# EAGLE design Ganganzeige_v2 (EAGLE 6.5.0)
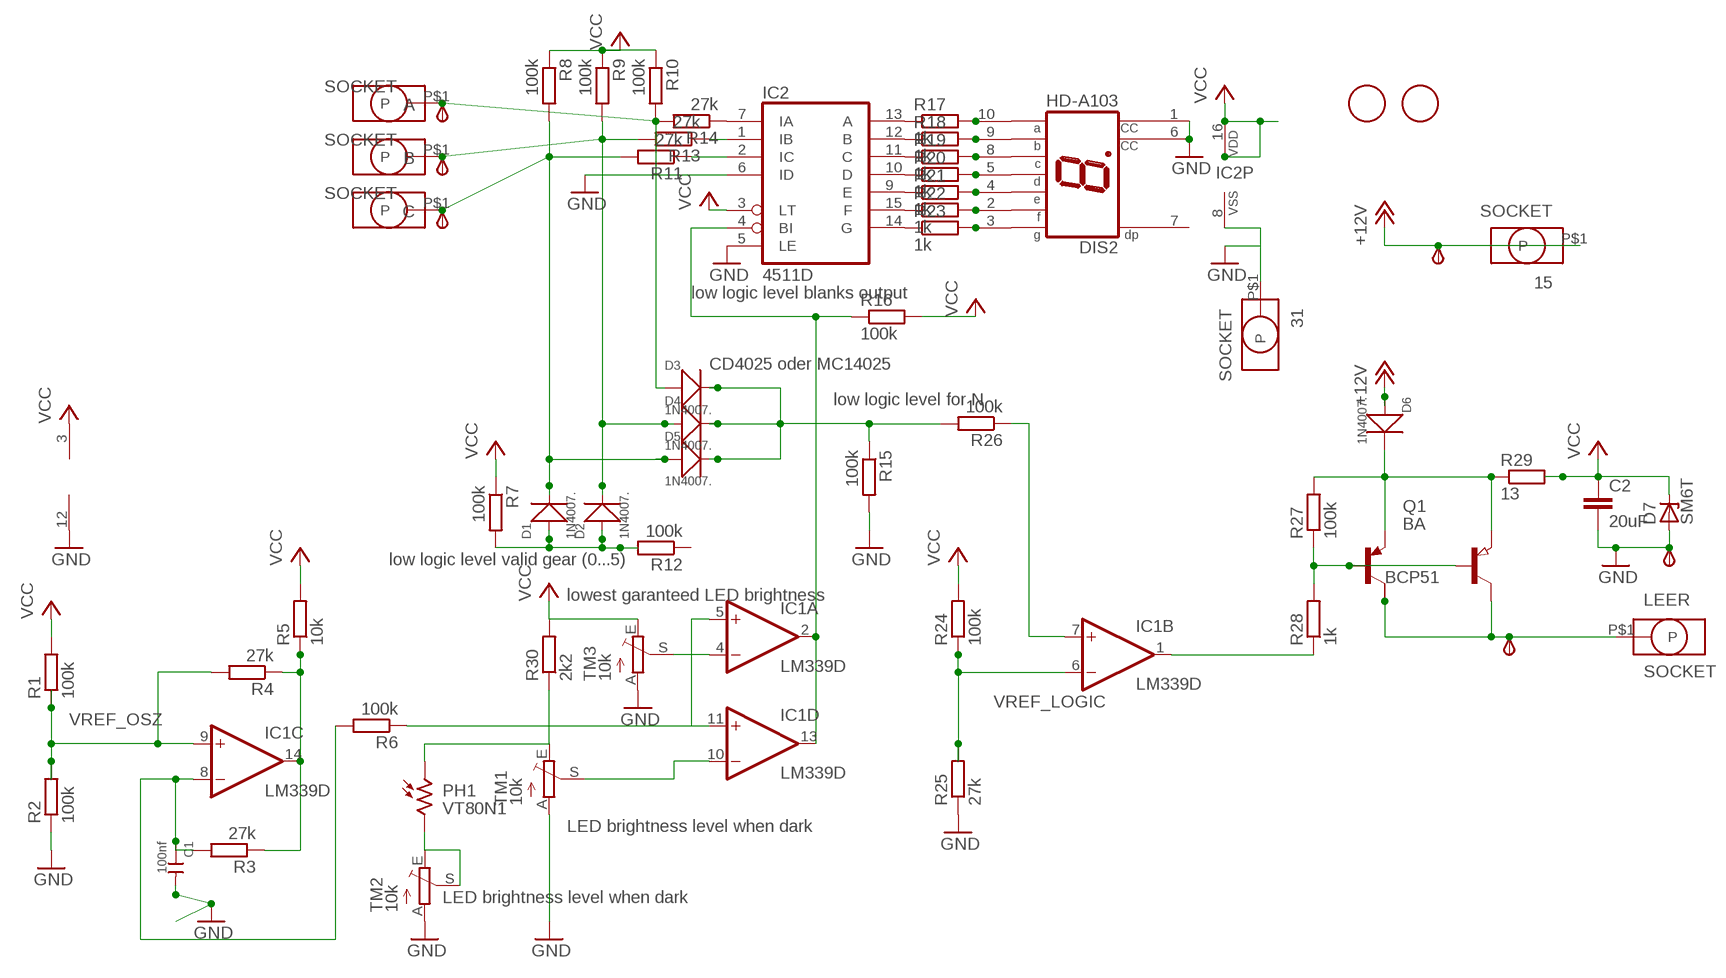
[diagram p0: schematic, sheet 1]

## Parts
15  SOCKET  [ID2.5MM]
15_  TPSB2.0  [B2.0]
31  SOCKET  [ID2.5MM]
A  SOCKET  [ID2.5MM]
A_  TPSB2.0  [B2.0]
B  SOCKET  [ID2.5MM]
B_  TPSB2.0  [B2.0]
C  SOCKET  [ID2.5MM]
C1  100nf  CERAMIC-100NF-50V-10%-X7R(0805)  [C0805]
C2  20uF  C-EUC1206K  [C1206K]
C_  TPSB2.0  [B2.0]
D1  1N4007.  DIODE-GEN-PURPOSE-1KV-1A(DO-214AC)  [DO-214AC]
D2  1N4007.  DIODE-GEN-PURPOSE-1KV-1A(DO-214AC)  [DO-214AC]
D3  1N4007.  DIODE-GEN-PURPOSE-1KV-1A(DO-214AC)  [DO-214AC]
D4  1N4007.  DIODE-GEN-PURPOSE-1KV-1A(DO-214AC)  [DO-214AC]
D5  1N4007.  DIODE-GEN-PURPOSE-1KV-1A(DO-214AC)  [DO-214AC]
D6  1N4007.  DIODE-GEN-PURPOSE-1KV-1A(DO-214AC)  [DO-214AC]
D7  SM6T  [DO214AA]
DIS2  HD-A103  [HDSP-A]
FID1  FIDUCIAL  [FIDUCIAL_1MM]
FID2  FIDUCIAL  [FIDUCIAL_1MM]
GND_  TPSB2.0  [B2.0]
IC1  LM339D  [SO14]
IC2  4511D  [SO16]
LEER  SOCKET  [ID2.5MM]
LEER_  TPSB2.0  [B2.0]
PH1  VT80N1  [VT800]
Q1  BA  PNP-TRANSISTOR_SOT89  [SOT89]
R1  100k  R-EU_R0805  [R0805]
R2  100k  R-EU_R0805  [R0805]
R3  27k  R-EU_R0805  [R0805]
R4  27k  R-EU_R0805  [R0805]
R5  10k  R-EU_R0805  [R0805]
R6  100k  R-EU_R0805  [R0805]
R7  100k  R-EU_R0805  [R0805]
R8  100k  R-EU_R0805  [R0805]
R9  100k  R-EU_R0805  [R0805]
R10  100k  R-EU_R0805  [R0805]
R11  27k  R-EU_R0805  [R0805]
R12  100k  R-EU_R0805  [R0805]
R13  27k  R-EU_R0805  [R0805]
R14  27k  R-EU_R0805  [R0805]
R15  100k  R-EU_R0805  [R0805]
R16  100k  R-EU_R0805  [R0805]
R17  1k  R-EU_R0805  [R0805]
R18  1k  R-EU_R0805  [R0805]
R19  1k  R-EU_R0805  [R0805]
R20  1k  R-EU_R0805  [R0805]
R21  1k  R-EU_R0805  [R0805]
R22  1k  R-EU_R0805  [R0805]
R23  1k  R-EU_R0805  [R0805]
R24  100k  R-EU_R0805  [R0805]
R25  27k  R-EU_R0805  [R0805]
R26  100k  R-EU_R0805  [R0805]
R27  100k  R-EU_R0805  [R0805]
R28  1k  R-EU_R0805  [R0805]
R29  13  R-EU_R1206  [R1206]
R30  2k2  R-EU_R0805  [R0805]
T  BCP53T1  [SOT223]
TM1  10k  TRIM_EU-S63X  [S63X]
TM2  10k  TRIM_EU-S63X  [S63X]
TM3  10k  TRIM_EU-S63X  [S63X]

## Nets
+12V: 15.P$1(P) 15_.TP(PP) D6.1(+)
GND: 31.P$1(P) C1.2 C2.2 D7.A DIS2.1(CC) DIS2.6(CC) GND_.TP(PP) IC1.12(P:GND) IC2.5(LE) IC2.6(ID) IC2.8(VSS) R2.1 R15.2 R25.1 TM1.A TM2.A TM3.A
N$1: IC2.13(A) R17.1
N$2: DIS2.10(A) R17.2
N$3: IC2.12(B) R18.1
N$4: DIS2.9(B) R18.2
N$5: IC2.11(C) R19.1
N$6: DIS2.8(C) R19.2
N$7: IC2.10(D) R20.1
N$8: DIS2.5(D) R20.2
N$9: IC2.9(E) R21.1
N$10: PH1.1 R30.1 TM1.E
N$11: DIS2.4(E) R21.2
N$12: IC2.15(F) R22.1
N$13: DIS2.2(F) R22.2
N$14: IC2.14(G) R23.1
N$15: DIS2.3(G) R23.2
N$16: A.P$1(P) A_.TP(PP) D3.1(+) R10.2 R14.2
N$17: B.P$1(P) B_.TP(PP) D2.2(-) D4.1(+) R9.2 R13.2
N$18: C.P$1(P) C_.TP(PP) D1.2(-) D5.1(+) R8.2 R11.2
N$21: IC1.1(B:OUT) R28.1
N$22: Q1.1(B) R27.1 R28.2 T.1(B)
N$24: PH1.2 TM2.E TM2.S
N$25: C1.1 IC1.8(C:-IN) R3.2 R6.2
N$26: IC1.14(C:OUT) R3.1 R4.1 R5.1
N$27: D1.1(+) D2.1(+) R7.2 R12.2
N$28: IC1.2(A:OUT) IC1.13(D:OUT) IC2.4(BI) R16.1
N$29: IC1.5(A:+IN) IC1.11(D:+IN) R6.1
N$30: IC1.10(D:-IN) TM1.S
N$31: IC1.4(A:-IN) TM3.S
N$32: IC1.7(B:+IN) R26.1
N$34: IC2.7(IA) R14.1
N$35: D3.2(-) D4.2(-) D5.2(-) R15.1 R26.2
N$36: IC2.2(IC) R11.1
N$37: IC2.1(IB) R13.1
VCC [VCC]: C2.1 D7.C IC1.3(P:V+) IC2.3(LT) IC2.16(VDD) R1.2 R5.2 R7.1 R8.1 R9.1 R10.1 R16.2 R24.2 R29.2 R30.2 TM3.E
VREF_LOGIC: IC1.6(B:-IN) R24.1 R25.2
VREF_OSZ: IC1.9(C:+IN) R1.1 R2.2 R4.2
ZUEND_EIN [Zuendplus]: D6.2(-) Q1.3(E) R27.2 R29.1 T.3(E)
ZUENDPLUS_OUT [Zuendplus]: LEER.P$1(P) LEER_.TP(PP) Q1.2(C) T.2(C)
Unconnected: DIS2.7(DP) R12.1 T.4(C/)

## Notes on the sheet
- low logic level blanks output
- CD4025 oder MC14025
- low logic level for N
- low logic level valid gear (0...5)
- lowest garanteed LED brightness
- LED brightness level when dark
- LED brightness level when dark

## Library data of the parts
15 31 A B C LEER = Brotbox_Socket_Header:SOCKET
15_ A_ B_ C_ GND_ LEER_ = testpin_BMW:TPS: TEST PIN
C1 = Seeed-Capacitor-2016:CERAMIC-100NF-50V-10%-X7R(0805): 302010165; MPN: CC0805KRX7R9BB104
C2 = rcl:C-EU: CAPACITOR, European symbol
D1-D6 = Diode-do214ac:DIODE-GEN-PURPOSE-1KV-1A(DO-214AC): 304010013; MPN: 1N4007; VALUE: 1N4007
D7 = Suppressor_Diode_DO214AA:SM6T: Z DIODE
DIS2 = display-hp:HD-A103: LED DISPLAY 1-character 7 segment, decimal point right; OC_FARNELL: unknown; OC_NEWARK: unknown
FID1 FID2 = Fiducial:FIDUCIAL: For use by pick and place machines to calibrate the vision/machine, 1mm By microbuilder.eu
IC1 = LM339:LM339: Low Power Low Offset Voltage Quad Comparators with open collector; LM139/LM239/LM339/LM2901/LM3302
IC2 = 45xx:4511: BCD to 7-segment LATCH/DECODER/DRIVER
PH1 = photo-elements:VT8: Photoconductive Cell VT800 Series Source: http://optoelectronics.perkinelmer.com/content/Datasheets/DTS_vt800seriesdatasheet.pdf
Q1 = Transistor_SOT89:PNP-TRANSISTOR_: PNP TRANSISTOR
R1-R30 = rcl:R-EU_: RESISTOR, European symbol
T = BCP53_:BCP53*; T: BCP51
TM1-TM3 = pot:TRIM_EU-: POTENTIOMETER

## Net classes
1 VCC: width 0.6 mm
2 Zuendplus: width 1 mm, drill 0.6 mm

## Board
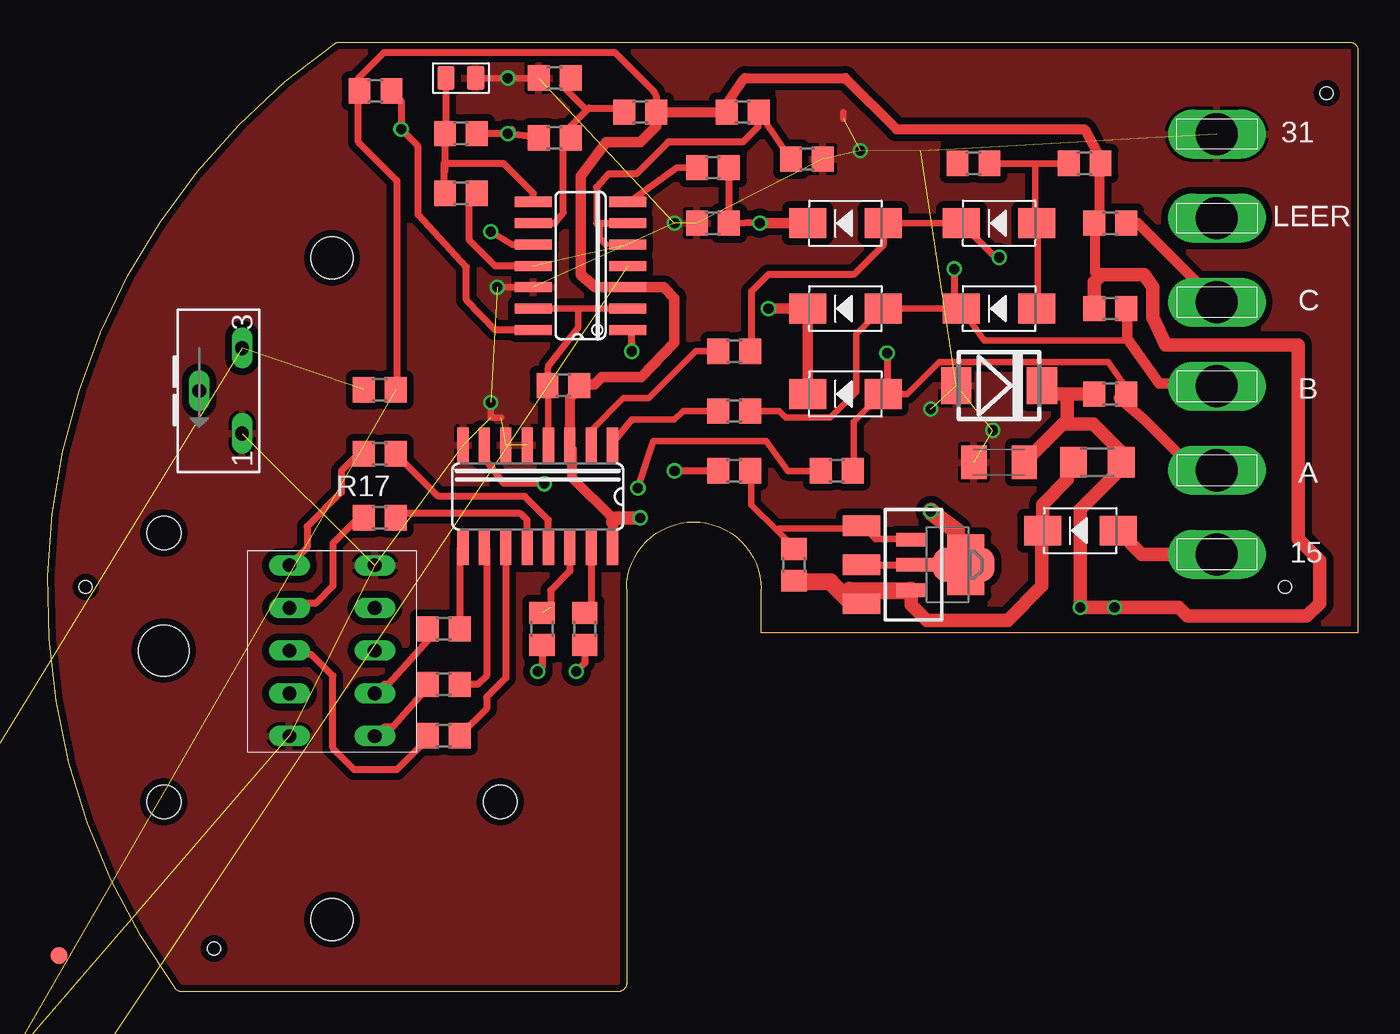
[diagram p1: board, top side]
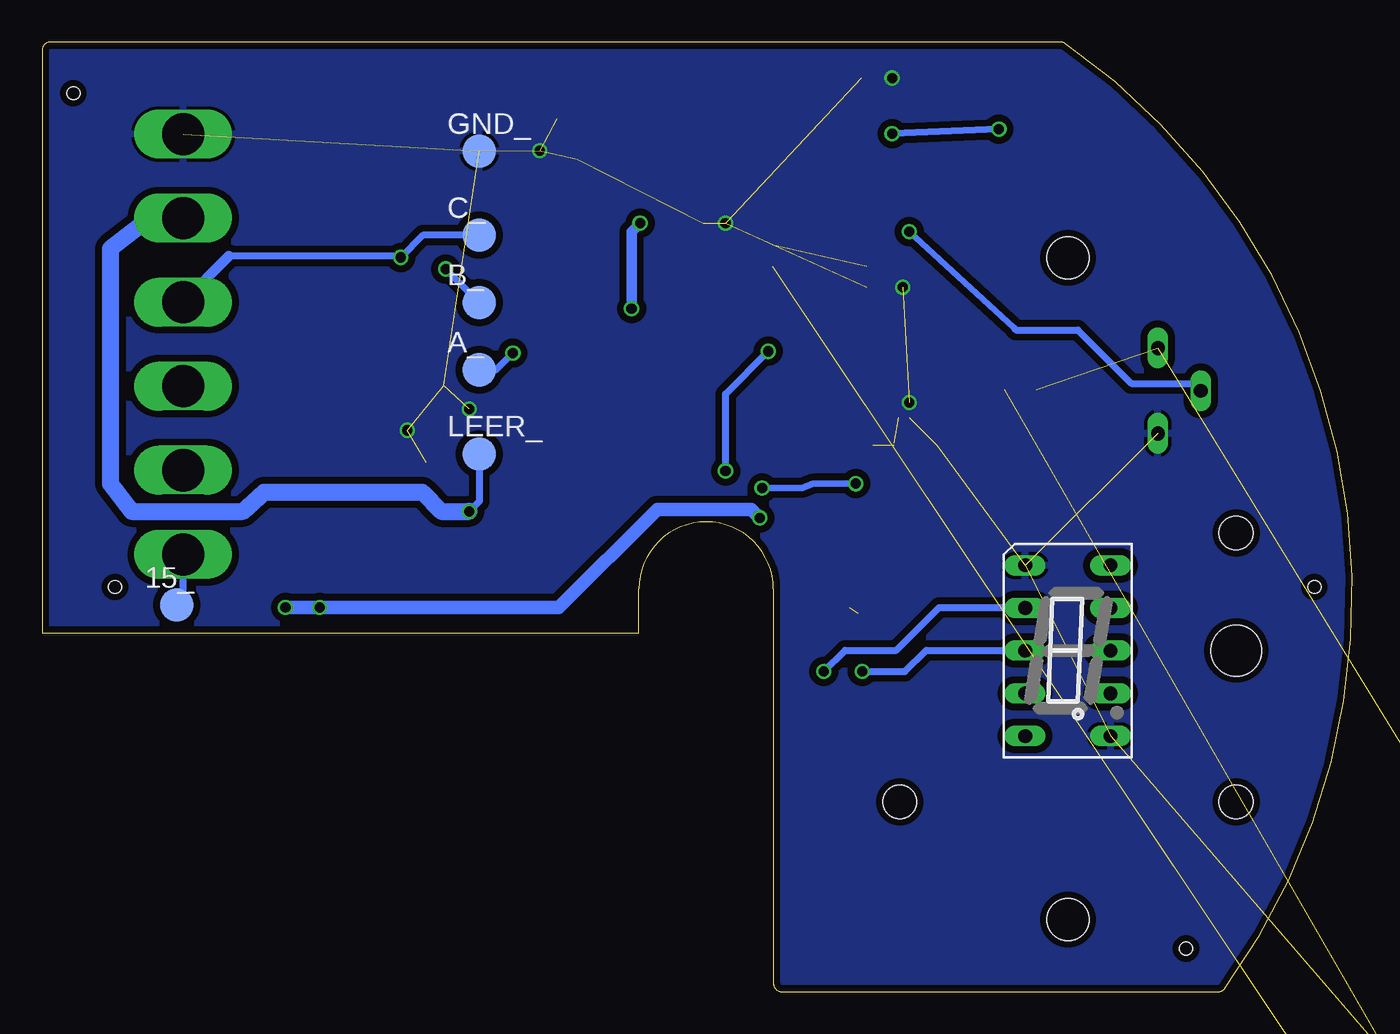
[diagram p2: board, bottom side, seen from below]

Size 77.9 x 56.5 mm. Coordinates in mm from the lower left corner, seen from the top.
Outline: 7.56,0.21 arc-91 17.05,56.41 arc-35 17.34,56.5 77.4,56.5 arc-90 77.9,56 77.9,21.34 42.42,21.34 42.42,23.95 arc180 34.42,23.95 34.42,0.5 arc-90 33.92,0 7.97,0 arc-54 7.56,0.21
Copper layers (1*16): Top 0.035mm / dielectric 1.5mm / Bottom 0.035mm
Design rules "Ganganzeige2b *": minimum track width 15mil, minimum drill 12mil, track to track 0.41mm, track to pad 12mil, pad to pad 0.205mm, via to via 0.205mm, smd to smd 6mil, copper to edge 0.4mm, drill to drill 8mil, minimum pad ring 8mil, minimum via ring 6mil, stop-mask expansion 3mil, vias tented up to drill 0mil, thermal gap 8mil
Holes 0.75 mm at 2.25,24.09 9.88,2.57 76.04,53.45 73.57,24.09
Holes 2.5 mm at 16.9,4.29 16.9,43.66
Holes 3 mm at 6.9,20.29
Holes 2 mm at 6.9,11.29 6.9,27.29 26.9,11.29

### Footprints (pad centres in the part's own frame; a part is rotated, then mirrored left to right if it is on the bottom)
ID2.5MM = drill 2.5 long: P$1 0,0
B2.0 = smd 2 x 2: TP 0,0
C0805 = smd 1.397 x 1.016: 1 0,0.889; 2 0,-0.889
C1206K = smd 1.5 x 2: 1 -1.5,0; 2 1.5,0
DO-214AC = smd 2.2 x 1.77: 1 -2.242,0; 2 2.242,0
DO214AA = smd 1.8 x 2.2: A 2.55,0; C -2.55,0
HDSP-A = drill 0.813 long: 1 -2.54,5.08; 2 -2.54,2.54; 3 -2.54,0; 4 -2.54,-2.54; 5 -2.54,-5.08; 6 2.54,-5.08; 7 2.54,-2.54; 8 2.54,0; 9 2.54,2.54; 10 2.54,5.08
FIDUCIAL_1MM = smd 1 x 1: 1 0,0
SO14 = smd 0.6 x 2.2: 1 -3.81,-2.8; 2 -2.54,-2.8; 3 -1.27,-2.8; 4 0,-2.8; 5 1.27,-2.8; 6 2.54,-2.8; 7 3.81,-2.8; 8 3.81,2.8; 9 2.54,2.8; 10 1.27,2.8; 11 0,2.8; 12 -1.27,2.8; 13 -2.54,2.8; 14 -3.81,2.8
SO16 = smd 0.66 x 2.032: 1 -4.445,-3.073; 2 -3.175,-3.073; 3 -1.905,-3.073; 4 -0.635,-3.073; 5 0.635,-3.073; 6 1.905,-3.073; 7 3.175,-3.073; 8 4.445,-3.073; 9 4.445,3.073; 10 3.175,3.073; 11 1.905,3.073; 12 0.635,3.073; 13 -0.635,3.073; 14 -1.905,3.073; 15 -3.175,3.073; 16 -4.445,3.073
VT800 = drill 0.8 pad 1.4: 1 -2.54,0; 2 2.54,0
SOT89 = smd 0.8 x 1.8: 1 -1.499,-2.181; 3 1.499,-2.181 | smd 0.8 x 2.3: 2 0,-1.927 | smd 2.032 x 3.65: 2@1 0,0.94
R0805 = smd 1.3 x 1.5: 1 -0.95,0; 2 0.95,0
R1206 = smd 1.6 x 1.803: 1 -1.422,0; 2 1.422,0
SOT223 = smd 1.219 x 2.235: 1 -2.311,-3.099; 2 0,-3.099; 3 2.311,-3.099 | smd 3.6 x 2.2: 4 0,3.099
S63X = drill 0.813 long: A 2.54,0; E -2.54,0; S 0,-2.54

### Placement (x,y rotation side)
15  69.52,26.02 0 top
15_  69.9,23 0 bottom
31  69.52,51.02 0 top
A  69.52,31.02 0 top
A_  51.9,37 0 bottom
B  69.52,36.02 0 top
B_  51.9,41 0 bottom
C  69.52,41.02 0 top
C1  24.56,54.36 90 top
C2  56.57,31.5 180 top
C_  51.9,45 0 bottom
D1  56.57,45.72 180 top
D2  56.57,40.64 180 top
D3  47.42,35.56 180 top
D4  47.42,40.64 180 top
D5  47.42,45.72 180 top
D6  61.39,27.43 180 top
D7  56.57,36.07 180 top
DIS2  16.9,20.29 0 bottom
FID1  82.11,50.91 0 top  (outside the outline)
FID2  0.66,2.16 0 top
GND_  51.9,50 0 bottom
IC1  31.68,43.18 90 top
IC2  29.14,29.46 180 top
LEER  69.52,46.02 0 top
LEER_  51.9,32 0 bottom
PH1  -7.69,2.79 0 top  (outside the outline)
Q1  53.52,25.4 270 top
R1  35.23,52.32 0 top
R2  30.15,54.36 0 top
R3  24.56,51.05 180 top
R4  30.15,50.8 0 top
R5  19.48,53.59 180 top
R6  24.56,47.5 180 top
R7  61.65,49.28 180 top
R8  63.17,45.72 0 top
R9  63.17,40.64 0 top
R10  63.17,35.56 0 top
R11  40.82,38.1 0 top
R12  55.04,49.28 0 top
R13  40.82,34.54 0 top
R14  46.92,30.99 0 top
R15  39.55,45.72 180 top
R16  30.66,36.07 0 top
R17  19.74,32 180 top
R18  19.74,28.19 180 top
R19  23.55,15.24 180 top
R20  23.55,18.29 180 top
R21  23.55,21.59 180 top
R22  31.93,21.59 270 top
R23  29.39,21.59 270 top
R24  41.33,52.32 180 top
R25  45.14,49.53 180 top
R26  39.55,49.02 0 top
R27  44.38,25.4 270 top
R28  40.82,30.99 0 top
R29  62.41,31.5 0 top
R30  19.74,35.81 0 top
T  51.49,25.4 270 top
TM1  11.55,35.75 270 top
TM2  -5.92,-5.33 0 top  (outside the outline)
TM3  -5.92,-14.73 0 top  (outside the outline)

### Tracks (layer width: path | path; a pad name or v marks a point on that pad's centre or on a via)
+12V
  Top 0.813: 15.P$1 65.04,26.02 D6.1
  Bottom 0.406: 15_.TP 69.52,23 15.P$1
GND  (via drill 0.6)  (21 unrouted)
  Top 0.381: 47.3,52.32 47.3,51.94 | R2.1 v27.36,54.36 C1.2 | IC1.12 v26.72,41.91 | 26.98,34.16 26.34,34.16 v26.34,35.05 | 28.5,32.64 IC2.5 | 27.23,32.64 IC2.6
  other vias: 48.31,50.04 52.5,34.67 56.19,33.4 37.26,45.72
  pour Bottom: 42.34,21.34 77.9,21.34 77.9,56.39 16.94,56.39 11.36,51.82 6.78,46.23 3.74,40.64 1.7,35.56 0.69,30.48 0.18,26.42 0.18,20.83 0.69,16.26 2.21,10.16 4.75,4.57 7.8,0 34.22,0 34.22,23.88 arc-90 38.28,27.94 38.79,27.94 arc-90 42.34,24.38
  pour Top: 15.42,56.64 -2.36,40.13 -2.36,1.52 1.2,-2.03 36.76,-2.03 36.76,20.32 77.9,20.32 77.78,22.35 77.78,56.52 77.27,56.64
N$1
  Top 0.406: IC2.13 29.77,28.07 28.37,29.46 23.23,29.46 R17.1
N$2
  Top 0.406: R17.2 18.47,32 17.45,30.99 17.45,29.72 15.42,27.69 15.42,26.42 DIS2.10
N$3
  Top 0.406: IC2.12 28.5,28.07 28.12,28.45 20.94,28.45 R18.1
N$4
  Top 0.406: R18.2 18.47,28.19 16.94,26.67 16.94,24.13 15.93,23.11 14.66,23.11 DIS2.9
N$5
  Top 0.406: IC2.11 27.23,18.67 26.09,17.53 26.09,16.83 R19.1
N$6
  Top 0.406: R19.2 22.6,15.05 20.75,13.21 18.21,13.21 16.94,14.48 16.94,18.8 15.67,20.07 14.53,20.07 DIS2.8
N$7
  Top 0.406: IC2.10 26.09,26.39 26.09,18.8 25.58,18.29 R20.1
N$8
  Top 0.406: R20.2 22.6,18.1 20.5,15.75 19.99,15.75 DIS2.5
N$9
  Top 0.406: IC2.9 24.5,26.39 R21.1
N$10  (2 unrouted)
N$11
  Top 0.406: R21.2 22.6,20.89 20.25,18.29 19.99,18.29 DIS2.4
N$12
  Top 0.406: IC2.15 32.31,22.92 R22.1
N$13  (via drill 0.6)
  Top 0.406: R22.2 31.93,19.56 v31.42,19.05
  Bottom 0.406: v31.42,19.05 30.15,20.32 27.1,20.32 24.56,22.86 19.48,22.86 DIS2.2
N$14  (1 unrouted)
  Top 0.406: IC2.14 31.04,25.02 29.9,23.88 29.9,22.86
N$15  (via drill 0.6)
  Top 0.406: R23.2 29.39,19.3 v29.14,19.05
  Bottom 0.406: v29.14,19.05 26.6,19.05 25.33,20.32 19.48,20.32 DIS2.3
N$16  (via drill 0.6)
  Top 0.381: 69.4,31.11 A.P$1 68,30.99 | R14.2 47.93,30.99 47.93,33.91 49.58,35.56 D3.1 51.11,35.56 53.01,37.47 63.05,37.47 64.32,35.69 R10.2
  Top 0.406: v49.9,38 49.9,35.8 D3.1
  Top 0.61: R10.2 63.68,35.31 65.2,34.04 67.49,31.75 68,30.99
  Bottom 0.381: 69.4,30.99 A.P$1
  Bottom 0.406: A_.TP 50.9,37 v49.9,38
N$17  (via drill 0.6)
  Top 0.381: 69.4,36.07 B.P$1 69.27,36.2 | 64.19,40.64 R9.2 64.19,40.39 64.06,38.73 55.68,38.73 54.41,40.51 D2.2 D4.1 49.58,40.64 48.06,39.12 48.06,35.69 46.54,34.16 43.87,34.16 43.49,34.54 R13.2
  Top 0.406: v53.9,43 53.9,41.06 D2.2
  Top 0.61: 64.19,40.64 64.19,40.39 64.19,38.86 66.09,36.2 69.27,36.2
  Bottom 0.381: 69.4,35.94 B.P$1
  Bottom 0.406: B_.TP v53.9,43
N$18  (via drill 0.6)
  Top 0.381: 69.4,41.15 C.P$1 69.27,41.27 | D5.1 D1.2
  Top 0.406: D5.1 49.67,44.41 47.93,42.67 42.85,42.67 41.84,41.66 41.84,38.17 R11.2 | D1.2 56.36,43.69 v56.57,43.69
  Top 0.61: R8.2 64.82,45.72 69.27,41.27
  Bottom 0.406: 66.79,43.75 56.63,43.75 v56.57,43.69 55.26,45 C_.TP | C.P$1
  Bottom 0.61: 66.79,43.75 C.P$1
N$21  (via drill 0.6)
  Top 0.406: R28.1 v37.26,30.99 | v34.72,38.1 34.72,38.61 34.73,39.12 IC1.1
  Bottom 0.406: v37.26,30.99 37.26,35.56 v34.72,38.1
N$22
  Top 0.381: Q1.1 51.23,26.92 49.2,26.92 48.44,27.69 T.1 48.31,27.56 43.49,27.56 43.36,27.43 | 43.36,27.43 44.38,26.42 R27.1 | 43.36,27.43 41.84,28.96 41.84,30.99 R28.2
N$24  (2 unrouted)
N$25
  Top 0.406: IC1.8 28.88,47.5 27.1,49.28 23.55,49.28 23.55,48.77 | 23.55,48.77 23.55,47.82 R6.2 | C1.1 23.68,51.37 R3.2 23.61,48.83 23.55,48.77
N$26  (via drill 0.6)
  Top 0.406: R4.1 v27.36,51.05 | v27.36,51.05 R3.1 | IC1.14 26.6,39.37 24.88,41.15 24.88,43.11 22.02,46.23 22.02,50.29 v21.01,51.31 21.01,53.02 R5.1 | v27.36,51.05 27.61,51.31
  Bottom 0.406: v21.01,51.31 v27.36,51.05
N$27
  Top 0.381: R7.2 58.73,49.28 | 58.73,49.28 R12.2 | 58.85,40.64 D2.1 58.85,40.77 58.85,45.59 D1.1 58.85,45.72 58.73,45.85 58.73,49.28
N$28
  Top 0.381: IC2.4 29.77,36.07 R16.1 29.64,36.2 29.77,37.21 31.55,39.5 31.55,40.64 | IC1.2 31.55,40.64 | 31.55,40.64 IC1.13
N$29  (1 unrouted)
  Top 0.406: IC1.11 26.6,43.18 25.07,44.7 25.07,47.31 R6.1
N$30  (via drill 0.6)
  Top 0.381: IC1.10 27.61,44.45 v26.34,45.21
  Bottom 0.381: 20.12,39.5 v26.34,45.21
  Bottom 0.406: 20.12,39.5 19.99,39.37 16.31,39.37 13.13,36.2 9.03,36.2 TM1.S
N$31  (1 unrouted)
N$32
  Top 0.381: R26.1 37.39,49.02 34.6,46.99 IC1.7
N$34  (via drill 0.6)
  Top 0.381: R14.1 44,30.99 42.73,32.77 35.99,32.77 v35.09,29.97 | v29.52,30.23 27.1,30.23 25.96,31.75 IC2.7
  Bottom 0.381: v29.52,30.23 32.06,30.23 32.69,29.97 v35.09,29.97
N$35  (via drill 0.6)
  Top 0.406: R26.2 R15.1 42.41,45.79 v42.34,45.72
  Top 0.61: D3.2 D4.2 v42.85,40.64 | D5.2 v42.34,45.72
  Bottom 0.61: v42.85,40.64 42.85,45.21 v42.34,45.72
N$36
  Top 0.381: R11.1 38.53,38.1 35.74,35.31 34.22,35.31 32.31,33.4 IC2.2
N$37
  Top 0.381: R13.1 37.77,34.54 37.26,34.04 34.72,34.04 33.58,32.64 IC2.1
VCC  (via drill 0.6)  (1 unrouted)
  Top 0.406: 18.47,53.53 18.47,50.55 20.75,48.26 20.75,35.88 R30.2 | 18.47,53.53 18.47,54.36 19.99,55.88 33.71,55.88 35.99,53.59 36.18,53.27 R1.2 | R5.2 18.47,53.53
  Top 0.6: 62.66,42.67 62.28,42.8 62.28,45.72 R8.1 62.54,45.85 62.54,49.28 R7.1 62.41,49.53 62.41,49.91 61.65,51.31 50.47,51.31 47.42,54.36 41.46,54.36 41.33,54.23 40.19,52.58 R24.2 R1.2 | R16.2 31.42,35.69 31.04,35.31 IC2.3 31.17,32.26 31.17,30.61 33.58,28.19 33.58,27.94 IC2.16
  Top 0.61: R1.2 36.18,51.5 35.23,50.55 33.2,50.55 31.68,48.51 31.68,42.67 32.57,41.91 IC1.3 36.63,41.91 37.26,41.27 37.26,38.61 35.3,36.58 32.95,36.58 32.5,36.13 31.68,36.13
  Top 0.813: R9.1 62.22,42.23 62.66,42.67 65.2,42.67 65.71,41.91 65.71,40.13 66.47,38.48 74.35,38.48 74.35,26.92 75.62,25.65 75.62,23.11 74.86,22.35 67.75,22.35 | 31.68,36.13 R16.2 | v35.23,28.19 33.84,28.19 33.58,27.94 | 67.74,22.35 67.24,22.86 v63.43,22.86 65.21,22.87 | 60.63,33.78 62.16,33.78 63.83,32.11 R29.2 63.83,31.14 61.39,28.7 v61.39,22.86 63.17,22.86 | 60.63,33.78 60.63,35.56 | 60.63,35.56 R10.1 | 60.63,35.56 59.63,35.56 D7.C | 60.63,33.78 60.35,33.78 C2.1
  Bottom 0.813: v35.23,28.19 35.74,28.7 41.33,28.7 47.17,22.86 v61.39,22.86 v63.43,22.86
VREF_LOGIC
  Top 0.381: R25.2 R24.1 | IC1.6
  Top 0.406: R24.1 42.22,52.26 42.22,51.44 41.33,50.55 36.88,50.55 34.98,48.64 33.33,48.64 32.64,47.88 32.64,45.72 32.82,45.72 | 32.82,45.72 IC1.6 | 33.2,44.45 32.82,44.83 32.82,45.72
VREF_OSZ
  Top 0.406: IC1.9 30.15,45.72 30.66,46.35 30.66,51.24 R4.2 30.91,51.31 32.06,52.45 | 32.06,52.45 32.18,52.58 34.03,52.58 R1.1 | R2.2 30.59,53.91 32.06,52.45
ZUEND_EIN
  Top 0.813: Q1.3 51.34,23.01 52.25,22.1 57.08,22.1 59.11,24.13 59.11,27.39 D6.2 59.15,29 60.63,30.48 60.63,31.14 R29.1
  Top 1: 47.36,23.56 47.81,23.11 48.31,23.11 T.3 | 47.36,23.56 46.54,24.38 44.38,24.38 R27.2 | Q1.3 51.23,23.88 47.68,23.88 47.36,23.56
ZUENDPLUS_OUT  (via drill 0.6)
  Top 0.406: T.2 Q1.2 54.03,25.4
  Top 1.016: v52.5,28.57 54.03,27.43 54.03,25.4
  Bottom 0.406: LEER_.TP 51.9,29.18 v52.5,28.57
  Bottom 1.016: LEER.P$1 71.5,46.02 73.84,44.2 73.84,30.23 72.57,28.57 65.97,28.57 64.7,29.72 55.3,29.72 54.16,28.57 v52.5,28.57